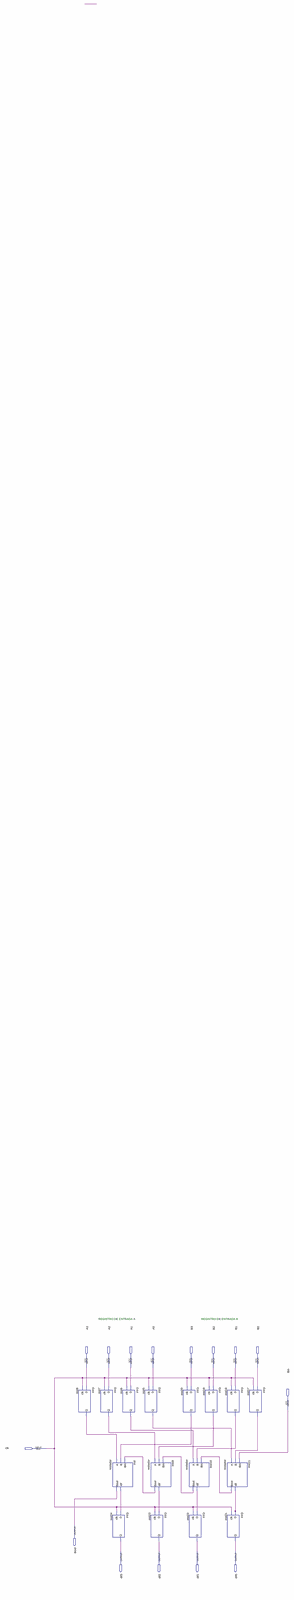
[diagram p0: schematic sheet, whole]
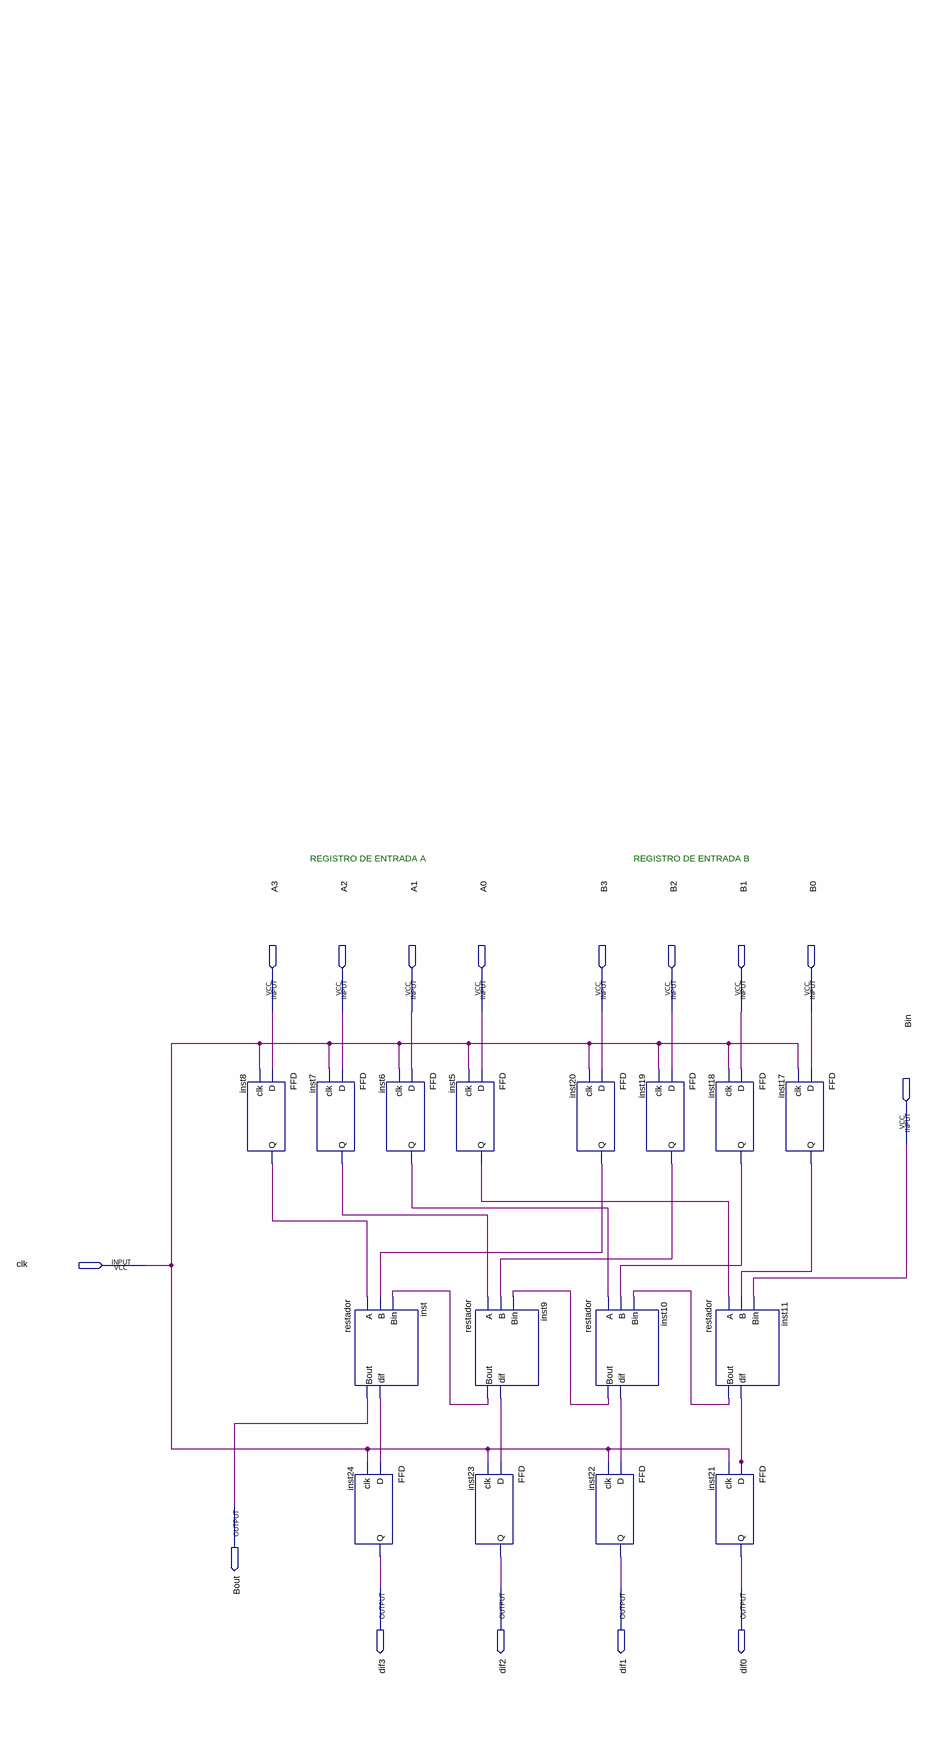
[diagram p1: schematic sheet, lower part]
// Quartus schematic restador4bits.bdf as structural Verilog: 16 symbols, 15 pins
module restador4bits (
  input  A3,
  input  A2,
  input  A1,
  input  A0,
  input  B3,
  input  B2,
  input  B1,
  input  B0,
  input  Bin,
  input  clk,
  output Bout,
  output dif3,
  output dif2,
  output dif1,
  output dif0
);

  wire inst5_q, inst6_q, inst7_q, inst8_q, inst9_bout, inst9_dif, inst10_bout, inst10_dif, inst11_bout,
       inst11_dif, inst17_q, inst18_q, inst19_q, inst20_q, inst_dif;

  FFD inst8 (.D(A3), .clk(clk), .Q(inst8_q));
  FFD inst7 (.D(A2), .clk(clk), .Q(inst7_q));
  restador inst (.A(inst8_q), .B(inst20_q), .Bin(inst9_bout), .Bout(Bout), .dif(inst_dif));
  FFD inst24 (.D(inst_dif), .clk(clk), .Q(dif3));
  FFD inst6 (.D(A1), .clk(clk), .Q(inst6_q));
  FFD inst5 (.D(A0), .clk(clk), .Q(inst5_q));
  restador inst9 (.A(inst7_q), .B(inst19_q), .Bin(inst10_bout), .Bout(inst9_bout), .dif(inst9_dif));
  FFD inst23 (.D(inst9_dif), .clk(clk), .Q(dif2));
  FFD inst20 (.D(B3), .clk(clk), .Q(inst20_q));
  restador inst10 (.A(inst6_q), .B(inst18_q), .Bin(inst11_bout), .Bout(inst10_bout), .dif(inst10_dif));
  FFD inst22 (.D(inst10_dif), .clk(clk), .Q(dif1));
  FFD inst19 (.D(B2), .clk(clk), .Q(inst19_q));
  FFD inst18 (.D(B1), .clk(clk), .Q(inst18_q));
  restador inst11 (.A(inst5_q), .B(inst17_q), .Bin(Bin), .Bout(inst11_bout), .dif(inst11_dif));
  FFD inst21 (.D(inst11_dif), .clk(clk), .Q(dif0));
  FFD inst17 (.D(B0), .clk(clk), .Q(inst17_q));

  // Notes on the sheet:
  //   REGISTRO DE ENTRADA A     
  //   REGISTRO DE ENTRADA B    
endmodule
